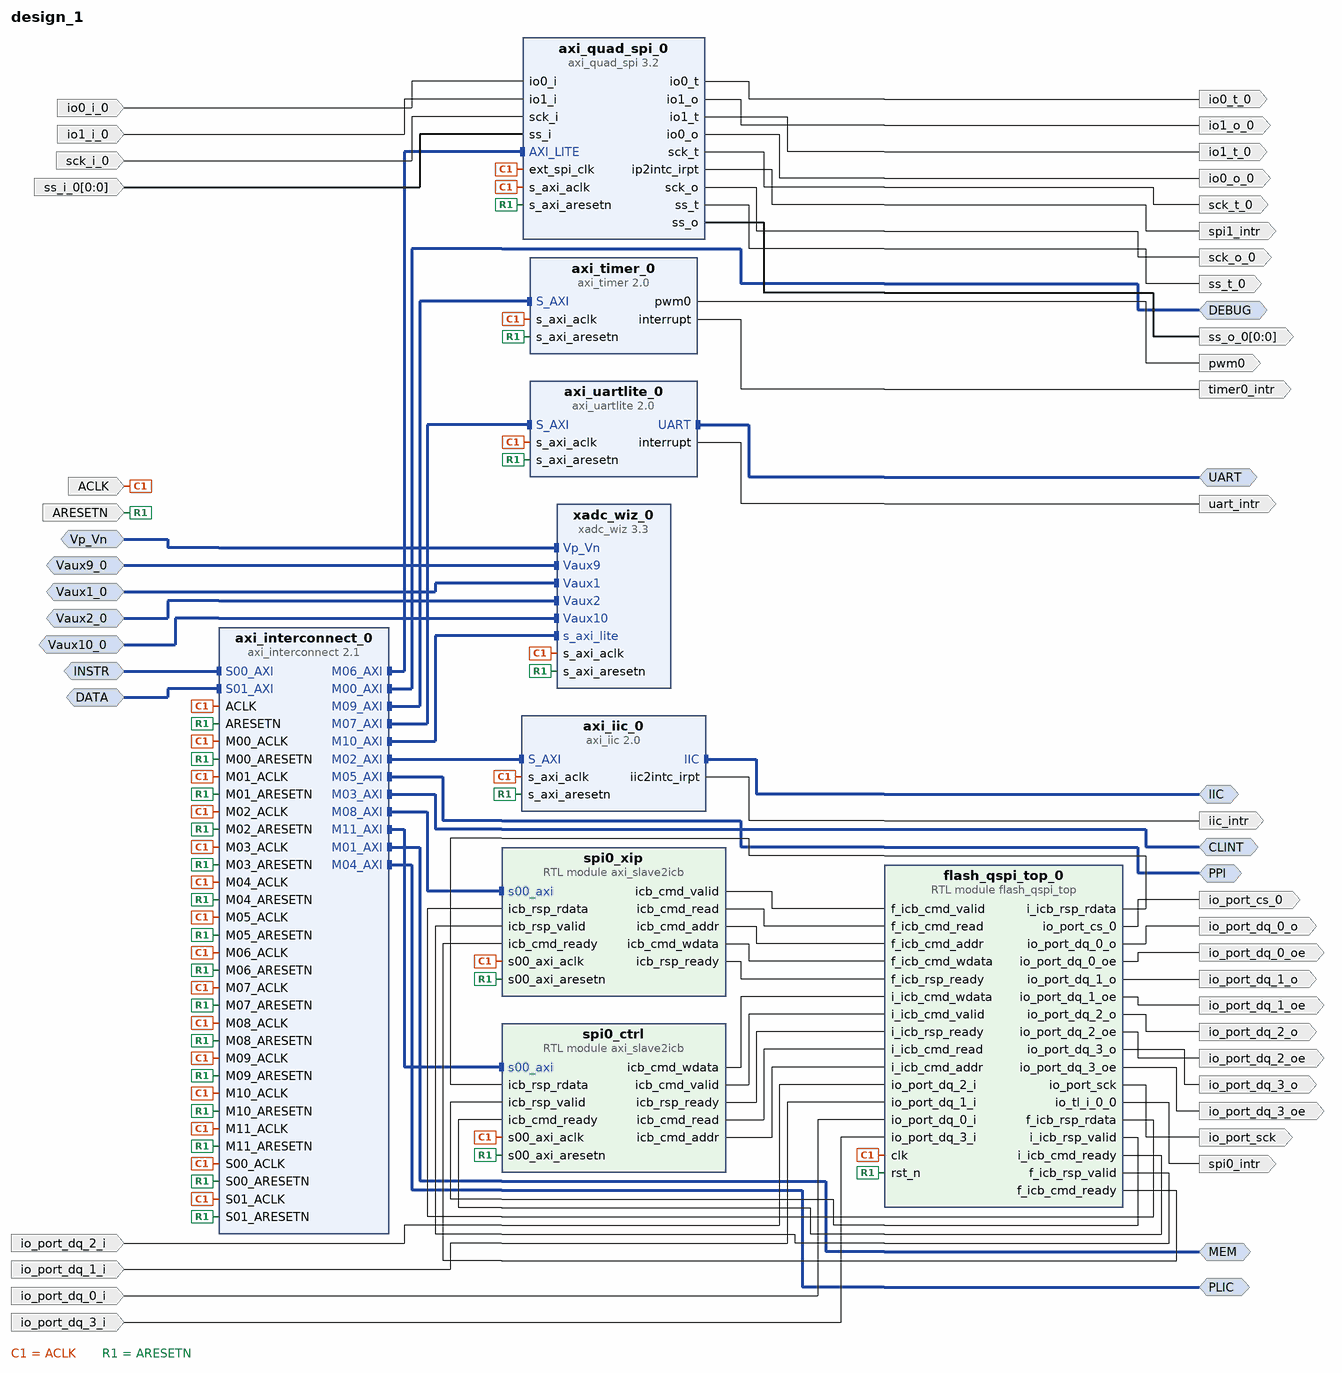
[diagram p0: block diagram of the top level]
# Vivado block design design_1, xc7a35tftg256-1, Vivado 2018.2
create_bd_design design_1

create_bd_intf_port -mode Slave -vlnv xilinx.com:interface:aximm_rtl:1.0 INSTR
set_property -dict [list \
  CONFIG.DATA_WIDTH 32 \
  CONFIG.PROTOCOL AXI4 \
  CONFIG.FREQ_HZ 50000000 \
  CONFIG.ID_WIDTH 1 \
  CONFIG.ADDR_WIDTH 32 \
  CONFIG.AWUSER_WIDTH 0 \
  CONFIG.ARUSER_WIDTH 0 \
  CONFIG.WUSER_WIDTH 0 \
  CONFIG.RUSER_WIDTH 0 \
  CONFIG.BUSER_WIDTH 0 \
  CONFIG.READ_WRITE_MODE READ_WRITE \
  CONFIG.HAS_BURST 1 \
  CONFIG.HAS_LOCK 1 \
  CONFIG.HAS_PROT 1 \
  CONFIG.HAS_CACHE 1 \
  CONFIG.HAS_QOS 1 \
  CONFIG.HAS_REGION 0 \
  CONFIG.HAS_WSTRB 1 \
  CONFIG.HAS_BRESP 1 \
  CONFIG.HAS_RRESP 1 \
  CONFIG.SUPPORTS_NARROW_BURST 1 \
  CONFIG.NUM_READ_OUTSTANDING 2 \
  CONFIG.NUM_WRITE_OUTSTANDING 2 \
  CONFIG.MAX_BURST_LENGTH 256 \
  CONFIG.NUM_READ_THREADS 1 \
  CONFIG.NUM_WRITE_THREADS 1 \
  CONFIG.RUSER_BITS_PER_BYTE 0 \
  CONFIG.WUSER_BITS_PER_BYTE 0 \
] [get_bd_intf_ports INSTR]
create_bd_intf_port -mode Slave -vlnv xilinx.com:interface:aximm_rtl:1.0 DATA
set_property -dict [list \
  CONFIG.DATA_WIDTH 32 \
  CONFIG.PROTOCOL AXI4 \
  CONFIG.FREQ_HZ 50000000 \
  CONFIG.ID_WIDTH 1 \
  CONFIG.ADDR_WIDTH 32 \
  CONFIG.AWUSER_WIDTH 0 \
  CONFIG.ARUSER_WIDTH 0 \
  CONFIG.WUSER_WIDTH 0 \
  CONFIG.RUSER_WIDTH 0 \
  CONFIG.BUSER_WIDTH 0 \
  CONFIG.READ_WRITE_MODE READ_WRITE \
  CONFIG.HAS_BURST 1 \
  CONFIG.HAS_LOCK 1 \
  CONFIG.HAS_PROT 1 \
  CONFIG.HAS_CACHE 1 \
  CONFIG.HAS_QOS 1 \
  CONFIG.HAS_REGION 0 \
  CONFIG.HAS_WSTRB 1 \
  CONFIG.HAS_BRESP 1 \
  CONFIG.HAS_RRESP 1 \
  CONFIG.SUPPORTS_NARROW_BURST 1 \
  CONFIG.NUM_READ_OUTSTANDING 2 \
  CONFIG.NUM_WRITE_OUTSTANDING 2 \
  CONFIG.MAX_BURST_LENGTH 256 \
  CONFIG.NUM_READ_THREADS 1 \
  CONFIG.NUM_WRITE_THREADS 1 \
  CONFIG.RUSER_BITS_PER_BYTE 0 \
  CONFIG.WUSER_BITS_PER_BYTE 0 \
] [get_bd_intf_ports DATA]
create_bd_intf_port -mode Master -vlnv xilinx.com:interface:aximm_rtl:1.0 DEBUG
set_property -dict [list \
  CONFIG.DATA_WIDTH 32 \
  CONFIG.PROTOCOL AXI4 \
  CONFIG.FREQ_HZ 50000000 \
  CONFIG.ADDR_WIDTH 32 \
  CONFIG.NUM_READ_OUTSTANDING 2 \
  CONFIG.NUM_WRITE_OUTSTANDING 2 \
] [get_bd_intf_ports DEBUG]
create_bd_intf_port -mode Master -vlnv xilinx.com:interface:aximm_rtl:1.0 PPI
set_property -dict [list \
  CONFIG.DATA_WIDTH 32 \
  CONFIG.PROTOCOL AXI4 \
  CONFIG.FREQ_HZ 50000000 \
  CONFIG.ADDR_WIDTH 32 \
  CONFIG.NUM_READ_OUTSTANDING 2 \
  CONFIG.NUM_WRITE_OUTSTANDING 2 \
] [get_bd_intf_ports PPI]
create_bd_intf_port -mode Master -vlnv xilinx.com:interface:aximm_rtl:1.0 CLINT
set_property -dict [list \
  CONFIG.DATA_WIDTH 32 \
  CONFIG.PROTOCOL AXI4 \
  CONFIG.FREQ_HZ 50000000 \
  CONFIG.ADDR_WIDTH 32 \
  CONFIG.NUM_READ_OUTSTANDING 2 \
  CONFIG.NUM_WRITE_OUTSTANDING 2 \
] [get_bd_intf_ports CLINT]
create_bd_intf_port -mode Master -vlnv xilinx.com:interface:aximm_rtl:1.0 PLIC
set_property -dict [list \
  CONFIG.DATA_WIDTH 32 \
  CONFIG.PROTOCOL AXI4 \
  CONFIG.FREQ_HZ 50000000 \
  CONFIG.ADDR_WIDTH 32 \
  CONFIG.NUM_READ_OUTSTANDING 2 \
  CONFIG.NUM_WRITE_OUTSTANDING 2 \
] [get_bd_intf_ports PLIC]
create_bd_intf_port -mode Master -vlnv xilinx.com:interface:aximm_rtl:1.0 MEM
set_property -dict [list \
  CONFIG.DATA_WIDTH 32 \
  CONFIG.PROTOCOL AXI4 \
  CONFIG.FREQ_HZ 50000000 \
  CONFIG.ADDR_WIDTH 32 \
  CONFIG.NUM_READ_OUTSTANDING 2 \
  CONFIG.NUM_WRITE_OUTSTANDING 2 \
] [get_bd_intf_ports MEM]
create_bd_intf_port -mode Master -vlnv xilinx.com:interface:uart_rtl:1.0 UART
create_bd_intf_port -mode Slave -vlnv xilinx.com:interface:diff_analog_io_rtl:1.0 Vp_Vn
create_bd_intf_port -mode Master -vlnv xilinx.com:interface:iic_rtl:1.0 IIC
create_bd_intf_port -mode Slave -vlnv xilinx.com:interface:diff_analog_io_rtl:1.0 Vaux9_0
create_bd_intf_port -mode Slave -vlnv xilinx.com:interface:diff_analog_io_rtl:1.0 Vaux1_0
create_bd_intf_port -mode Slave -vlnv xilinx.com:interface:diff_analog_io_rtl:1.0 Vaux2_0
create_bd_intf_port -mode Slave -vlnv xilinx.com:interface:diff_analog_io_rtl:1.0 Vaux10_0
create_bd_port -dir I -type clk ACLK
set_property -dict {CONFIG.FREQ_HZ 50000000} [get_bd_ports ACLK]
create_bd_port -dir I -type rst ARESETN
create_bd_port -dir O -type intr uart_intr
create_bd_port -dir O pwm0
create_bd_port -dir O -type intr timer0_intr
create_bd_port -dir O io_port_dq_2_oe
create_bd_port -dir O io_port_dq_0_oe
create_bd_port -dir O io_port_sck
create_bd_port -dir I io_port_dq_2_i
create_bd_port -dir I io_port_dq_1_i
create_bd_port -dir O io_port_dq_0_o
create_bd_port -dir I io_port_dq_0_i
create_bd_port -dir O io_port_dq_3_oe
create_bd_port -dir O io_port_dq_3_o
create_bd_port -dir O io_port_dq_2_o
create_bd_port -dir O io_port_dq_1_oe
create_bd_port -dir O -type intr spi0_intr
create_bd_port -dir O io_port_cs_0
create_bd_port -dir I io_port_dq_3_i
create_bd_port -dir O io_port_dq_1_o
create_bd_port -dir O sck_t_0
create_bd_port -dir O -type intr spi1_intr
create_bd_port -dir O io1_t_0
create_bd_port -dir O io1_o_0
create_bd_port -dir O io0_t_0
create_bd_port -dir O ss_t_0
create_bd_port -dir I io0_i_0
create_bd_port -dir I io1_i_0
create_bd_port -dir I sck_i_0
create_bd_port -dir I -from 0 -to 0 ss_i_0
create_bd_port -dir O -type intr iic_intr
create_bd_port -dir O sck_o_0
create_bd_port -dir O -from 0 -to 0 ss_o_0
create_bd_port -dir O io0_o_0

create_bd_cell -type module -reference axi_slave2icb spi0_ctrl
create_bd_cell -type module -reference axi_slave2icb spi0_xip
create_bd_cell -type ip -vlnv xilinx.com:ip:axi_iic:2.0 axi_iic_0
create_bd_cell -type ip -vlnv xilinx.com:ip:axi_interconnect:2.1 axi_interconnect_0
set_property -dict [list \
  CONFIG.NUM_SI 2 \
  CONFIG.NUM_MI 12 \
  CONFIG.M05_HAS_REGSLICE 0 \
  CONFIG.M07_HAS_REGSLICE 0 \
  CONFIG.M10_HAS_REGSLICE 0 \
  CONFIG.M11_HAS_REGSLICE 0 \
  CONFIG.M12_HAS_REGSLICE 0 \
  CONFIG.M07_HAS_DATA_FIFO 0 \
  CONFIG.M11_HAS_DATA_FIFO 0 \
  CONFIG.M12_HAS_DATA_FIFO 0 \
] [get_bd_cells axi_interconnect_0]
create_bd_cell -type ip -vlnv xilinx.com:ip:axi_quad_spi:3.2 axi_quad_spi_0
set_property -dict [list \
  CONFIG.C_USE_STARTUP 0 \
  CONFIG.C_SCK_RATIO 8 \
  CONFIG.C_FIFO_DEPTH 16 \
  CONFIG.C_S_AXI4_ID_WIDTH 0 \
] [get_bd_cells axi_quad_spi_0]
create_bd_cell -type ip -vlnv xilinx.com:ip:axi_timer:2.0 axi_timer_0
set_property -dict {CONFIG.mode_64bit 0} [get_bd_cells axi_timer_0]
create_bd_cell -type ip -vlnv xilinx.com:ip:axi_uartlite:2.0 axi_uartlite_0
set_property -dict [list \
  CONFIG.C_BAUDRATE 128000 \
  CONFIG.C_S_AXI_ACLK_FREQ_HZ 50000000 \
  CONFIG.C_S_AXI_ACLK_FREQ_HZ_d 50 \
] [get_bd_cells axi_uartlite_0]
create_bd_cell -type ip -vlnv xilinx.com:ip:xadc_wiz:3.3 xadc_wiz_0
set_property -dict [list \
  CONFIG.INTERFACE_SELECTION Enable_AXI \
  CONFIG.XADC_STARUP_SELECTION independent_adc \
  CONFIG.DCLK_FREQUENCY 50 \
  CONFIG.ADC_CONVERSION_RATE 308 \
  CONFIG.SEQUENCER_MODE Off \
  CONFIG.ENABLE_RESET false \
  CONFIG.OT_ALARM false \
  CONFIG.USER_TEMP_ALARM true \
  CONFIG.VCCINT_ALARM true \
  CONFIG.VCCAUX_ALARM true \
  CONFIG.SINGLE_CHANNEL_SELECTION VP_VN \
  CONFIG.EXTERNAL_MUX_CHANNEL VP_VN \
  CONFIG.CHANNEL_ENABLE_VP_VN false \
  CONFIG.CHANNEL_ENABLE_VAUXP0_VAUXN0 false \
  CONFIG.CHANNEL_ENABLE_VAUXP1_VAUXN1 true \
  CONFIG.CHANNEL_ENABLE_VAUXP2_VAUXN2 true \
  CONFIG.CHANNEL_ENABLE_VAUXP9_VAUXN9 true \
  CONFIG.CHANNEL_ENABLE_VAUXP10_VAUXN10 true \
] [get_bd_cells xadc_wiz_0]
create_bd_cell -type module -reference flash_qspi_top flash_qspi_top_0

# ---- connections ----

connect_bd_intf_net [get_bd_intf_pins axi_interconnect_0/M06_AXI] [get_bd_intf_pins axi_quad_spi_0/AXI_LITE]
connect_bd_intf_net [get_bd_intf_pins axi_interconnect_0/M09_AXI] [get_bd_intf_pins axi_timer_0/S_AXI]
connect_bd_intf_net [get_bd_intf_pins axi_interconnect_0/M10_AXI] [get_bd_intf_pins xadc_wiz_0/s_axi_lite]
connect_bd_intf_net [get_bd_intf_pins spi0_ctrl/s00_axi] [get_bd_intf_pins axi_interconnect_0/M11_AXI]
connect_bd_intf_net [get_bd_intf_pins axi_interconnect_0/M02_AXI] [get_bd_intf_pins axi_iic_0/S_AXI]
connect_bd_intf_net [get_bd_intf_pins spi0_xip/s00_axi] [get_bd_intf_pins axi_interconnect_0/M08_AXI]
connect_bd_intf_net [get_bd_intf_pins axi_uartlite_0/S_AXI] [get_bd_intf_pins axi_interconnect_0/M07_AXI]
connect_bd_intf_net [get_bd_intf_ports INSTR] [get_bd_intf_pins axi_interconnect_0/S00_AXI]
connect_bd_intf_net [get_bd_intf_ports DATA] [get_bd_intf_pins axi_interconnect_0/S01_AXI]
connect_bd_intf_net [get_bd_intf_ports DEBUG] [get_bd_intf_pins axi_interconnect_0/M00_AXI]
connect_bd_intf_net [get_bd_intf_ports PPI] [get_bd_intf_pins axi_interconnect_0/M05_AXI]
connect_bd_intf_net [get_bd_intf_ports CLINT] [get_bd_intf_pins axi_interconnect_0/M03_AXI]
connect_bd_intf_net [get_bd_intf_ports PLIC] [get_bd_intf_pins axi_interconnect_0/M04_AXI]
connect_bd_intf_net [get_bd_intf_ports MEM] [get_bd_intf_pins axi_interconnect_0/M01_AXI]
connect_bd_intf_net [get_bd_intf_ports UART] [get_bd_intf_pins axi_uartlite_0/UART]
connect_bd_intf_net [get_bd_intf_ports Vp_Vn] [get_bd_intf_pins xadc_wiz_0/Vp_Vn]
connect_bd_intf_net [get_bd_intf_ports IIC] [get_bd_intf_pins axi_iic_0/IIC]
connect_bd_intf_net -intf_net Vaux9_0_1 [get_bd_intf_ports Vaux9_0] [get_bd_intf_pins xadc_wiz_0/Vaux9]
connect_bd_intf_net -intf_net Vaux1_0_1 [get_bd_intf_ports Vaux1_0] [get_bd_intf_pins xadc_wiz_0/Vaux1]
connect_bd_intf_net -intf_net Vaux2_0_1 [get_bd_intf_ports Vaux2_0] [get_bd_intf_pins xadc_wiz_0/Vaux2]
connect_bd_intf_net -intf_net Vaux10_0_1 [get_bd_intf_ports Vaux10_0] [get_bd_intf_pins xadc_wiz_0/Vaux10]
connect_bd_net [get_bd_ports ACLK] \
  [get_bd_pins spi0_ctrl/s00_axi_aclk] [get_bd_pins spi0_xip/s00_axi_aclk] [get_bd_pins axi_iic_0/s_axi_aclk] \
  [get_bd_pins axi_quad_spi_0/ext_spi_clk] [get_bd_pins axi_quad_spi_0/s_axi_aclk] [get_bd_pins axi_timer_0/s_axi_aclk] \
  [get_bd_pins axi_uartlite_0/s_axi_aclk] [get_bd_pins xadc_wiz_0/s_axi_aclk] [get_bd_pins flash_qspi_top_0/clk] \
  [get_bd_pins axi_interconnect_0/ACLK] [get_bd_pins axi_interconnect_0/S00_ACLK] [get_bd_pins axi_interconnect_0/S01_ACLK] \
  [get_bd_pins axi_interconnect_0/M00_ACLK] [get_bd_pins axi_interconnect_0/M01_ACLK] \
  [get_bd_pins axi_interconnect_0/M02_ACLK] [get_bd_pins axi_interconnect_0/M03_ACLK] \
  [get_bd_pins axi_interconnect_0/M04_ACLK] [get_bd_pins axi_interconnect_0/M05_ACLK] \
  [get_bd_pins axi_interconnect_0/M06_ACLK] [get_bd_pins axi_interconnect_0/M07_ACLK] \
  [get_bd_pins axi_interconnect_0/M08_ACLK] [get_bd_pins axi_interconnect_0/M09_ACLK] \
  [get_bd_pins axi_interconnect_0/M10_ACLK] [get_bd_pins axi_interconnect_0/M11_ACLK]
connect_bd_net [get_bd_ports ARESETN] \
  [get_bd_pins spi0_ctrl/s00_axi_aresetn] [get_bd_pins spi0_xip/s00_axi_aresetn] [get_bd_pins axi_iic_0/s_axi_aresetn] \
  [get_bd_pins axi_quad_spi_0/s_axi_aresetn] [get_bd_pins axi_timer_0/s_axi_aresetn] \
  [get_bd_pins axi_uartlite_0/s_axi_aresetn] [get_bd_pins xadc_wiz_0/s_axi_aresetn] [get_bd_pins flash_qspi_top_0/rst_n] \
  [get_bd_pins axi_interconnect_0/ARESETN] [get_bd_pins axi_interconnect_0/S00_ARESETN] \
  [get_bd_pins axi_interconnect_0/S01_ARESETN] [get_bd_pins axi_interconnect_0/M00_ARESETN] \
  [get_bd_pins axi_interconnect_0/M01_ARESETN] [get_bd_pins axi_interconnect_0/M02_ARESETN] \
  [get_bd_pins axi_interconnect_0/M03_ARESETN] [get_bd_pins axi_interconnect_0/M04_ARESETN] \
  [get_bd_pins axi_interconnect_0/M05_ARESETN] [get_bd_pins axi_interconnect_0/M06_ARESETN] \
  [get_bd_pins axi_interconnect_0/M07_ARESETN] [get_bd_pins axi_interconnect_0/M08_ARESETN] \
  [get_bd_pins axi_interconnect_0/M09_ARESETN] [get_bd_pins axi_interconnect_0/M10_ARESETN] \
  [get_bd_pins axi_interconnect_0/M11_ARESETN]
connect_bd_net [get_bd_pins axi_uartlite_0/interrupt] [get_bd_ports uart_intr]
connect_bd_net [get_bd_pins axi_timer_0/pwm0] [get_bd_ports pwm0]
connect_bd_net [get_bd_pins axi_timer_0/interrupt] [get_bd_ports timer0_intr]
connect_bd_net [get_bd_pins flash_qspi_top_0/io_port_dq_2_oe] [get_bd_ports io_port_dq_2_oe]
connect_bd_net [get_bd_pins spi0_xip/icb_cmd_valid] [get_bd_pins flash_qspi_top_0/f_icb_cmd_valid]
connect_bd_net [get_bd_pins flash_qspi_top_0/i_icb_rsp_rdata] [get_bd_pins spi0_ctrl/icb_rsp_rdata]
connect_bd_net [get_bd_pins spi0_ctrl/icb_cmd_wdata] [get_bd_pins flash_qspi_top_0/i_icb_cmd_wdata]
connect_bd_net [get_bd_pins flash_qspi_top_0/io_port_dq_0_oe] [get_bd_ports io_port_dq_0_oe]
connect_bd_net [get_bd_pins flash_qspi_top_0/io_port_sck] [get_bd_ports io_port_sck]
connect_bd_net [get_bd_pins flash_qspi_top_0/f_icb_rsp_rdata] [get_bd_pins spi0_xip/icb_rsp_rdata]
connect_bd_net [get_bd_pins flash_qspi_top_0/f_icb_rsp_valid] [get_bd_pins spi0_xip/icb_rsp_valid]
connect_bd_net [get_bd_pins spi0_xip/icb_cmd_read] [get_bd_pins flash_qspi_top_0/f_icb_cmd_read]
connect_bd_net [get_bd_pins spi0_xip/icb_cmd_addr] [get_bd_pins flash_qspi_top_0/f_icb_cmd_addr]
connect_bd_net [get_bd_pins spi0_ctrl/icb_cmd_valid] [get_bd_pins flash_qspi_top_0/i_icb_cmd_valid]
connect_bd_net [get_bd_ports io_port_dq_2_i] [get_bd_pins flash_qspi_top_0/io_port_dq_2_i]
connect_bd_net [get_bd_ports io_port_dq_1_i] [get_bd_pins flash_qspi_top_0/io_port_dq_1_i]
connect_bd_net [get_bd_pins flash_qspi_top_0/io_port_dq_0_o] [get_bd_ports io_port_dq_0_o]
connect_bd_net [get_bd_pins spi0_ctrl/icb_rsp_ready] [get_bd_pins flash_qspi_top_0/i_icb_rsp_ready]
connect_bd_net [get_bd_pins spi0_ctrl/icb_cmd_read] [get_bd_pins flash_qspi_top_0/i_icb_cmd_read]
connect_bd_net [get_bd_pins spi0_xip/icb_cmd_wdata] [get_bd_pins flash_qspi_top_0/f_icb_cmd_wdata]
connect_bd_net [get_bd_pins flash_qspi_top_0/i_icb_rsp_valid] [get_bd_pins spi0_ctrl/icb_rsp_valid]
connect_bd_net [get_bd_pins flash_qspi_top_0/i_icb_cmd_ready] [get_bd_pins spi0_ctrl/icb_cmd_ready]
connect_bd_net [get_bd_ports io_port_dq_0_i] [get_bd_pins flash_qspi_top_0/io_port_dq_0_i]
connect_bd_net [get_bd_pins flash_qspi_top_0/io_port_dq_3_oe] [get_bd_ports io_port_dq_3_oe]
connect_bd_net [get_bd_pins flash_qspi_top_0/io_port_dq_3_o] [get_bd_ports io_port_dq_3_o]
connect_bd_net [get_bd_pins flash_qspi_top_0/io_port_dq_2_o] [get_bd_ports io_port_dq_2_o]
connect_bd_net [get_bd_pins flash_qspi_top_0/io_port_dq_1_oe] [get_bd_ports io_port_dq_1_oe]
connect_bd_net [get_bd_pins flash_qspi_top_0/f_icb_cmd_ready] [get_bd_pins spi0_xip/icb_cmd_ready]
connect_bd_net [get_bd_pins flash_qspi_top_0/io_tl_i_0_0] [get_bd_ports spi0_intr]
connect_bd_net [get_bd_pins flash_qspi_top_0/io_port_cs_0] [get_bd_ports io_port_cs_0]
connect_bd_net [get_bd_ports io_port_dq_3_i] [get_bd_pins flash_qspi_top_0/io_port_dq_3_i]
connect_bd_net [get_bd_pins flash_qspi_top_0/io_port_dq_1_o] [get_bd_ports io_port_dq_1_o]
connect_bd_net [get_bd_pins spi0_xip/icb_rsp_ready] [get_bd_pins flash_qspi_top_0/f_icb_rsp_ready]
connect_bd_net [get_bd_pins spi0_ctrl/icb_cmd_addr] [get_bd_pins flash_qspi_top_0/i_icb_cmd_addr]
connect_bd_net [get_bd_pins axi_quad_spi_0/sck_t] [get_bd_ports sck_t_0]
connect_bd_net [get_bd_pins axi_quad_spi_0/ip2intc_irpt] [get_bd_ports spi1_intr]
connect_bd_net [get_bd_pins axi_quad_spi_0/io1_t] [get_bd_ports io1_t_0]
connect_bd_net [get_bd_pins axi_quad_spi_0/io1_o] [get_bd_ports io1_o_0]
connect_bd_net [get_bd_pins axi_quad_spi_0/io0_t] [get_bd_ports io0_t_0]
connect_bd_net [get_bd_pins axi_quad_spi_0/ss_t] [get_bd_ports ss_t_0]
connect_bd_net -net io0_i_0_1 [get_bd_ports io0_i_0] [get_bd_pins axi_quad_spi_0/io0_i]
connect_bd_net -net io1_i_0_1 [get_bd_ports io1_i_0] [get_bd_pins axi_quad_spi_0/io1_i]
connect_bd_net -net sck_i_0_1 [get_bd_ports sck_i_0] [get_bd_pins axi_quad_spi_0/sck_i]
connect_bd_net -net ss_i_0_1 [get_bd_ports ss_i_0] [get_bd_pins axi_quad_spi_0/ss_i]
connect_bd_net [get_bd_pins axi_iic_0/iic2intc_irpt] [get_bd_ports iic_intr]
connect_bd_net [get_bd_pins axi_quad_spi_0/sck_o] [get_bd_ports sck_o_0]
connect_bd_net [get_bd_pins axi_quad_spi_0/ss_o] [get_bd_ports ss_o_0]
connect_bd_net [get_bd_pins axi_quad_spi_0/io0_o] [get_bd_ports io0_o_0]

# ---- address map ----
assign_bd_address -offset 0x00000000 -range 4K -target_address_space [get_bd_addr_spaces DATA] [get_bd_addr_segs DEBUG/Reg]
assign_bd_address -offset 0x02000000 -range 64K -target_address_space [get_bd_addr_spaces DATA] [get_bd_addr_segs CLINT/Reg]
assign_bd_address -offset 0x0C000000 -range 16M -target_address_space [get_bd_addr_spaces DATA] [get_bd_addr_segs PLIC/Reg]
assign_bd_address -offset 0x10014000 -range 16K -target_address_space [get_bd_addr_spaces DATA] [get_bd_addr_segs spi0_ctrl/s00_axi/reg0]
assign_bd_address -offset 0x20000000 -range 256M -target_address_space [get_bd_addr_spaces DATA] [get_bd_addr_segs spi0_xip/s00_axi/reg0]
assign_bd_address -offset 0x40600000 -range 64K -target_address_space [get_bd_addr_spaces DATA] [get_bd_addr_segs axi_uartlite_0/S_AXI/Reg]
assign_bd_address -offset 0x40800000 -range 64K -target_address_space [get_bd_addr_spaces DATA] [get_bd_addr_segs axi_iic_0/S_AXI/Reg]
assign_bd_address -offset 0x41C00000 -range 64K -target_address_space [get_bd_addr_spaces DATA] [get_bd_addr_segs axi_timer_0/S_AXI/Reg]
assign_bd_address -offset 0x44A00000 -range 64K -target_address_space [get_bd_addr_spaces DATA] [get_bd_addr_segs xadc_wiz_0/s_axi_lite/Reg]
assign_bd_address -offset 0x44A30000 -range 64K -target_address_space [get_bd_addr_spaces DATA] [get_bd_addr_segs axi_quad_spi_0/AXI_LITE/Reg]
assign_bd_address -offset 0x44A40000 -range 4K -target_address_space [get_bd_addr_spaces DATA] [get_bd_addr_segs MEM/Reg]
assign_bd_address -offset 0x50000000 -range 256M -target_address_space [get_bd_addr_spaces DATA] [get_bd_addr_segs PPI/Reg]
assign_bd_address -offset 0x00000000 -range 4K -target_address_space [get_bd_addr_spaces INSTR] [get_bd_addr_segs DEBUG/Reg]
assign_bd_address -offset 0x02000000 -range 64K -target_address_space [get_bd_addr_spaces INSTR] [get_bd_addr_segs CLINT/Reg]
assign_bd_address -offset 0x0C000000 -range 16M -target_address_space [get_bd_addr_spaces INSTR] [get_bd_addr_segs PLIC/Reg]
assign_bd_address -offset 0x10014000 -range 16K -target_address_space [get_bd_addr_spaces INSTR] [get_bd_addr_segs spi0_ctrl/s00_axi/reg0]
assign_bd_address -offset 0x20000000 -range 256M -target_address_space [get_bd_addr_spaces INSTR] [get_bd_addr_segs spi0_xip/s00_axi/reg0]
assign_bd_address -offset 0x40600000 -range 64K -target_address_space [get_bd_addr_spaces INSTR] [get_bd_addr_segs axi_uartlite_0/S_AXI/Reg]
assign_bd_address -offset 0x40800000 -range 64K -target_address_space [get_bd_addr_spaces INSTR] [get_bd_addr_segs axi_iic_0/S_AXI/Reg]
assign_bd_address -offset 0x41C00000 -range 64K -target_address_space [get_bd_addr_spaces INSTR] [get_bd_addr_segs axi_timer_0/S_AXI/Reg]
assign_bd_address -offset 0x44A00000 -range 64K -target_address_space [get_bd_addr_spaces INSTR] [get_bd_addr_segs xadc_wiz_0/s_axi_lite/Reg]
assign_bd_address -offset 0x44A30000 -range 64K -target_address_space [get_bd_addr_spaces INSTR] [get_bd_addr_segs axi_quad_spi_0/AXI_LITE/Reg]
assign_bd_address -offset 0x44A40000 -range 4K -target_address_space [get_bd_addr_spaces INSTR] [get_bd_addr_segs MEM/Reg]
assign_bd_address -offset 0x50000000 -range 256M -target_address_space [get_bd_addr_spaces INSTR] [get_bd_addr_segs PPI/Reg]

validate_bd_design
save_bd_design
